# Altium project ECE_491.PrjPcb
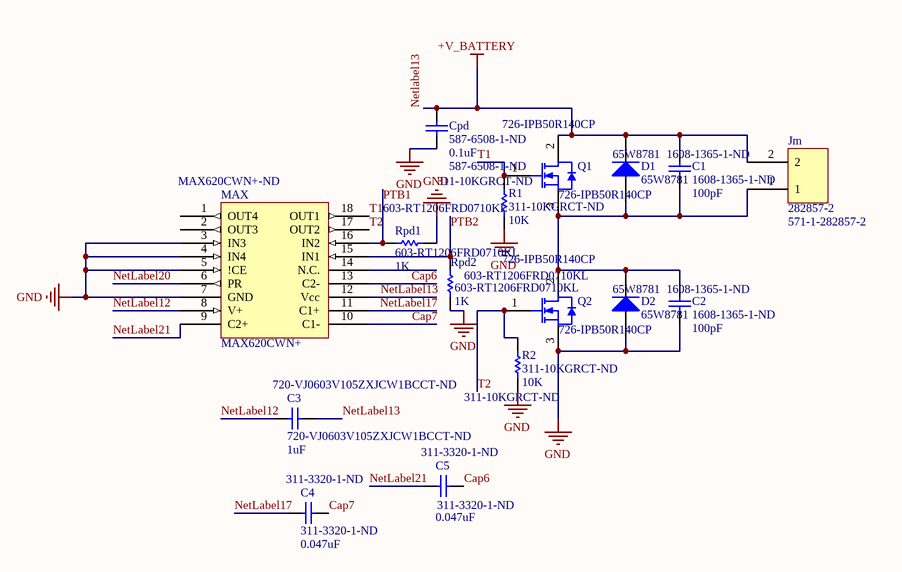
[diagram p0: MotorController.SchDoc]
3 sheets, 43 parts. Net scope: global (net labels, ports and power ports of the same name join across sheets).
Board file: FRDM-Shield3.PcbDoc
Sheets:
  MotorController.SchDoc
  Connectors.SchDoc
  PSU.SchDoc

## Sheet MotorController.SchDoc
size A

### Parts
C1  1608-1365-1-ND  value 100pF  [1608[0603]]
C2  1608-1365-1-ND  value 100pF  [1608[0603]]
C3  720-VJ0603V105ZXJCW1BCCT-ND  value 1uF  [C1206]
C4  311-3320-1-ND  value 0.047uF  [C1206]
C5  311-3320-1-ND  value 0.047uF  [C1206]
Cpd  587-6508-1-ND  value 0.1uF  [C1206]
D1  65W8781  [SMC]
D2  65W8781  [SMC]
Jm  282857-2  Supplier Part Number 1: 571-1-282857-2  [282857-2]
MAX  MAX620CWN+  Supplier Part Number 2: MAX620CWN+-ND  [SOIC-SO18_L]
Q1  726-IPB50R140CP  [INF-PG-TO263-3-2_N]
Q2  726-IPB50R140CP  [INF-PG-TO263-3-2_N]
R1  311-10KGRCT-ND  value 10K  [C1206]
R2  311-10KGRCT-ND  value 10K  [C1206]
Rpd1  603-RT1206FRD0710KL  value 1K  [C1206]
Rpd2  603-RT1206FRD0710KL  value 1K  [C1206]

### Nets
GND: C2.1 Cpd.1 D2.1(A) MAX.3(IN3) MAX.4(IN4) MAX.5(!CE) MAX.7(GND) Q2.3(SOURCE) R1.1 R2.1 Rpd1.2 Rpd2.1
NetLabel13: C1.2 C3.2 Cpd.2 D1.2(K) Jm.2 MAX.12(Vcc) Q1.2(DRAIN)  [also labelled +V_BATTERY]
Cap6: C5.1 MAX.13(C2-)
Cap7: C4.2 MAX.10(C1-)
NetLabel12: C3.1 MAX.8(V+)
NetLabel17: C4.1 MAX.11(C1+)
NetLabel20: MAX.6(PR)
NetLabel21: C5.2 MAX.9(C2+)
PTB1: MAX.16(IN2) Rpd1.1
PTB2: MAX.15(IN1) Rpd2.2
T1: MAX.18(OUT1) Q1.1(GATE) R1.2
T2: MAX.17(OUT2) Q2.1(GATE) R2.2
NetC1_1: C1.1 C2.2 D1.1(A) D2.2(K) Jm.1 Q1.3(SOURCE) Q2.2(DRAIN)

Not connected (* = marked no-connect by the designer): MAX 1(OUT4) 2(OUT3) 14(N.C.)

### Library data of the parts
C1 C2 = Cap: Multilayer Ceramic Capacitors MLCC - SMD/SMT 0603 100pF 50V 5% Tol C0G, Digi-key; Manufacturer: Knowles Syfer; Manufacturer Part Number: 0603Y0500101JCT; Dissipation Factor: 0.1%; Capacitance: 50pF; Published: 8-Jun-2000; LatestRevisionDate: 17-Jul-2002; LatestRevisionNote: Re-released for DXP Platform.; PackageReference: RAD-0.3; Publisher: Altium Limited; PackageDescription: Radial Cap, Thru-Hole; 2 Leads; 0.3 in Pin Spacing; Supplier 1: Digi-Key; Supplier 2: Digi-Key; Supplier Part Number 2: 1608-1365-1-ND; RoHS: Yes; Category: Ceramic Capacitors; Stock 2: 32028; Pricing 2: 1=0.59000, 10=0.42000, 100=0.27650, 500=0.20480, 1000=0.17407 (USD); Case/Package: 0603; Case Code (Imperial): 0603; Case Code (Metric): 1608; Min Operating Temperature: -55°C; Max Operating Temperature: 125°C; Termination: SMD/SMT; Composition: Ceramic; Dielectric: C0G; Tolerance: 5%; Packaging: Tape and Reel; Package Quantity: 4000; Voltage Rating: 50V; Voltage Rating (DC): 50V; Length: 1.6mm; Depth: 0.8mm; ComponentLink1URL: https://datasheet.ciiva.com/5428/tandardmlccdatasheet-369797-5428107.pdf?src-supplier=Mouser; ComponentLink1Description: https://datasheet.ciiva.com/5428/tandardmlccdatasheet-369797-5428107.pdf?src-supplier=Mouser
C3 = Cap: Cap Ceramic 1uF 16V Y5V -20% to 80% SMD 0603 85C Paper T/R, Digi-key; Manufacturer: Vishay Vitramon; Dielectric Material: Tantalum; Published: 8-Jun-2000; LatestRevisionDate: 17-Jul-2002; LatestRevisionNote: Re-released for DXP Platform.; PackageReference: RAD-0.3; Publisher: Altium Limited; PackageDescription: Radial Cap, Thru-Hole; 2 Leads; 0.3 in Pin Spacing; Supplier 1: Digi-Key; Supplier Part Number 1: 720-VJ0603V105ZXJCW1BCCT-ND; Manufacturer Part Number: VJ0603V105ZXJCW1BC; RoHS: Yes; Category: Ceramic Capacitors; Stock 1: 4000; Pricing 1: 1=0.29000, 10=0.19600, 100=0.09910, 500=0.06784, 1000=0.06001 (USD); Mount: Surface Mount; Case/Package: 0603; Min Operating Temperature: -25°C; Max Operating Temperature: 85°C; Capacitance: 1uF; Tolerance: 80%; Dielectric: Y5V; Voltage Rating (DC): 16V; Length: 1.6mm; Depth: 0.8mm; Lead Free: Lead Free; ComponentLink1URL: https://datasheet.ciiva.com/11489/vjw1bcbascomseries-11489855.pdf?src-supplier=Avnet; ComponentLink1Description: https://datasheet.ciiva.com/11489/vjw1bcbascomseries-11489855.pdf?src-supplier=Avnet
C4 C5 = Cap: CAP CER 0.47UF 4V X5R 0201, Digi-key; Manufacturer: Yageo; Manufacturer Part Number: CC0201MRX5R4BB474; Capacitance: 470nF; Tolerance: 20%; Published: 8-Jun-2000; LatestRevisionDate: 17-Jul-2002; LatestRevisionNote: Re-released for DXP Platform.; PackageReference: RAD-0.3; Publisher: Altium Limited; PackageDescription: Radial Cap, Thru-Hole; 2 Leads; 0.3 in Pin Spacing; Supplier 1: Digi-Key; Supplier Part Number 1: 311-3320-1-ND; RoHS: Yes; Category: Ceramic Capacitors; Stock 1: 31395; Pricing 1: 1=0.10000, 10=0.07100, 100=0.03150, 500=0.02252, 1000=0.01770, 2500=0.01609, 5000=0.01480 (USD); Mount: Surface Mount; Case/Package: 0201; Min Operating Temperature: -55°C; Max Operating Temperature: 85°C; Packaging: Tape and Reel; Voltage Rating: 4V; Length: 0.024inch; Width: 0.012inch; Thickness: 0.013inch; ComponentLink1URL: http://www.yageo.com/documents/recent/UPY-GPHC_X5R_4V-to-50V_23.pdf?src-supplier=Digi-Key; ComponentLink1Description: http://www.yageo.com/documents/recent/UPY-GPHC_X5R_4V-to-50V_23.pdf?src-supplier=Digi-Key; ComponentLink2URL: http://www.yageo.com/documents/recent/UPY-GPHC_X5R_4V-to-50V_25.pdf?src-supplier=Digi-Key; ComponentLink2Description: http://www.yageo.com/documents/recent/UPY-GPHC_X5R_4V-to-50V_25.pdf?src-supplier=Digi-Key
Cpd = Cap: Multilayer Ceramic Capacitor 0.1uF 50V 10% 1206 Emboss T/R, Digikey; Manufacturer: Taiyo Yuden; Manufacturer Part Number: UMF316B7104KLHT; Published: 8-Jun-2000; LatestRevisionDate: 17-Jul-2002; LatestRevisionNote: Re-released for DXP Platform.; PackageReference: RAD-0.3; Publisher: Altium Limited; PackageDescription: Radial Cap, Thru-Hole; 2 Leads; 0.3 in Pin Spacing; Supplier 1: Digi-Key; Supplier Part Number 1: 587-6508-1-ND; RoHS: No; Stock 1: 3880; Pricing 1: 1=0.48000, 10=0.33200, 100=0.19920, 500=0.14942, 1000=0.12618 (USD)
D1 D2 = Diode: MULTICOMP - 1N4007 - DIODE, STANDARD, 1A, 1000V,DO-41, Newark; Forward Voltage: 1.1V; Max Repetitive Reverse Voltage (Vrrm): 1kV; Max Forward Surge Current (Ifsm): 30A; Element Configuration: Single; Published: 8-Jun-2000; LatestRevisionDate: 17-Jul-2002; LatestRevisionNote: Re-released for DXP Platform.; PackageVersion: Sep-1996; PackageReference: SMC; Publisher: Altium Limited; PackageDescription: DO-214-AB/SMC; 2 C-Bend Leads; Body 7.9 x 5.9 mm, inc. leads (LxW); Code_JEDEC: DO-214-AB; Supplier 1: Newark; Supplier 2: Newark; Supplier Part Number 2: 65W8781; Manufacturer: Multicomp; Manufacturer Part Number: 1N4007; RoHS: Yes; Category: Rectifier Diodes; Stock 2: 270000; Pricing 2: 1=0.02200, 5000=0.02200, 10000=0.02000, 15000=0.01700, 25000=0.01400, 50000=0.01200 (USD); Number of Pins: 2; Min Operating Temperature: -65°C; Max Operating Temperature: 150°C; Forward Current: 1A; REACH SVHC: No SVHC; ComponentLink1URL: https://datasheet.ciiva.com/1176/58590-1176850.pdf?src-supplier=Element14; ComponentLink1Description: https://datasheet.ciiva.com/1176/58590-1176850.pdf?src-supplier=Element14; ComponentLink2URL: https://datasheet.ciiva.com/1176/41320-1176847.pdf?src-supplier=Element14; ComponentLink2Description: https://datasheet.ciiva.com/1176/41320-1176847.pdf?src-supplier=Element14; ComponentLink3URL: https://datasheet.ciiva.com/1239/1505911-1239362.pdf?src-supplier=Newark; ComponentLink3Description: https://datasheet.ciiva.com/1239/1505911-1239362.pdf?src-supplier=Newark
MAX = MAX620CPN: MAXIM INTEGRATED PRODUCTS         MAX620CWN+             MOSFET Driver, 4.5V-16.5V supply, WSOIC-18, Digi-key; Max Supply Current: 500uA; Number of Outputs: 4; Max Supply Voltage: 16.5V; Min Supply Voltage: 4.5V; Max Output Current: 25mA; Max Power Dissipation: 762mW; Fall Time: 2500ns; Rise Time: 1700ns; Supplier 1: Digi-Key; Manufacturer: Maxim; Manufacturer Part Number: MAX620CWN+; RoHS: Yes; Category: Gate Drivers; Stock 2: 99; Pricing 2: 1=7.24000, 10=6.54000, 25=6.23600, 100=5.17140, 250=4.71512, 500=4.67708 (USD); Mount: Surface Mount; Case/Package: SOIC; Number of Pins: 18; Min Operating Temperature: 0°C; Max Operating Temperature: 70°C; Number of Drivers: 4; Nominal Supply Current: 500uA; Packaging: Rail/Tube; Package Quantity: 40; Radiation Hardening: No; Lead Free: Lead Free; REACH SVHC: Unknown; ComponentLink1URL: https://datasheet.ciiva.com/26879/max620cwn-26879943.pdf?src-supplier=IIIC; ComponentLink1Description: https://datasheet.ciiva.com/26879/max620cwn-26879943.pdf?src-supplier=IIIC
Q1 Q2 = CMP-1164-00461-1: N-Channel CoolMOS Power-Transistor, 500 V VDS, 23 A ID, -55 to 150 degC, PG-TO263-3-2, Reel, Green, Mouser; Manufacturer: Infineon; Polarity: N; VGS(th) (max): 3.5Â V; RthJC (max): 0.65Â K/W; VGS(th) (min): 2.5Â V; VDS (max): 500Â V; RthJA (max): 62Â K/W; IDpuls (max): 56Â A; RDS (on) (max): 140Â mOhm; Green: TRUE; ID (max): 23Â A; QG: 48Â nC; Ptot (max): 192Â W; ComponentLink1URL: http://www.infineon.com/; PackageDescription: 3-Pin Plastic (Green) Transistor Single Outline Package, 10 x 9.25 mm Body, 2.54 mm Pitch; ComponentLink3URL: http://www.infineon.com/dgdl/BTS141TC_DS_10.pdf?folderId=db3a3043163797a6011667aa084c0e01&fileId=db3a3043242ebc9e01242f43f58b003e&location=en.Products.Automotive_ICs.Smart_High-_and_Low-Side_Switches.HITFET___TEMPFET__-_Smart_Low-Side_Switches.DATASHEET.BT; Technology: CoolMOS CP; ComponentLink3Description: Package Specification; PackageVersion: Jul-09; Halogen-free: TRUE; ComponentLink2URL: http://www.infineon.com/dgdl/IPB50R140CP_rev2.0.pdf?folderId=db3a304412b407950112b408e8c90004&fileId=db3a304412b407950112b42d4eb4484f; Packing: Reel; DatasheetVersion: Rev. 2.0; ComponentLink2Description: Datasheet; ComponentLink1Description: Manufacturer URL; PartNumber: IPB50R140CP; PackageReference: PG-TO263-3-2; Mounting Technology: Surface Mount; Rth: 0.65Â K/W; Supplier 1: Mouser; Supplier Part Number 1: 726-IPB50R140CP
R1 R2 = Res1: Surface Mount Thick Film Resistor, RC Series, 10 kohm, 100 mW, - 5%, 50 V, 0603 [1608 Metric], Digi-key; Manufacturer: Yageo; Manufacturer Part Number: RC0603JR-0710KL; Temperature Coefficient: 100ppm/°C; Resistance: 10kR; Voltage Rating (DC): 50V; Max Power Dissipation: 100mW; Published: 8-Jun-2000; LatestRevisionDate: 17-Jul-2002; LatestRevisionNote: Re-released for DXP Platform.; PackageReference: AXIAL-0.3; Publisher: Altium Limited; PackageDescription: Axial Device, Thru-Hole; 2 Leads; 0.3 in Pin Spacing; Supplier 1: Digi-Key; Supplier Part Number 1: 311-10KGRCT-ND; RoHS: Yes; Category: Chip SMD Resistors; Stock 1: 2424073; Pricing 1: 1=0.10000, 10=0.01900, 100=0.00770, 1000=0.00347, 2500=0.00301 (USD); Case/Package: 0603; Number of Pins: 2; Contact Plating: Tin,Matte; Case Code (Imperial): 0603; Case Code (Metric): 1608; Min Operating Temperature: -55°C; Max Operating Temperature: 155°C; Composition: Thick Film; Tolerance: 5%; Packaging: Tape and Reel; Features: Moisture Resistant; Number of Terminations: 2; Termination: SMD/SMT; Military Standard: Not; Power Rating: 100mW; Voltage Rating: 50V; Length: 0.063inch; Width: 0.031inch; Height - Seated (Max): 0.022inch; Depth: 0.8mm; Radiation Hardening: No; Lead Free: Lead Free; REACH SVHC: Unknown; ComponentLink1URL: https://datasheet.ciiva.com/2452/pyu-rc-group-51-rohs-l-10-2452848.pdf?src-supplier=Digi-Key; ComponentLink1Description: https://datasheet.ciiva.com/2452/pyu-rc-group-51-rohs-l-10-2452848.pdf?src-supplier=Digi-Key
Rpd1 Rpd2 = Res1: RES SMD 10K OHM 1% 1/4W 1206, Mouser; Manufacturer: Yageo; Max Power Dissipation: 250mW; Temperature Coefficient: 25ppm/°C; Resistance: 10kR; Published: 8-Jun-2000; LatestRevisionDate: 17-Jul-2002; LatestRevisionNote: Re-released for DXP Platform.; PackageReference: AXIAL-0.3; Publisher: Altium Limited; PackageDescription: Axial Device, Thru-Hole; 2 Leads; 0.3 in Pin Spacing; Supplier 1: Mouser; Supplier Part Number 1: 603-RT1206FRD0710KL; Manufacturer Part Number: RT1206FRD0710KL; RoHS: Yes; Category: Chip SMD Resistors; Stock 1: 8660; Pricing 1: 1=0.15000, 10=0.09100, 100=0.03000, 1000=0.02100, 5000=0.01600, 10000=0.01500 (USD); Case/Package: 1206; Min Operating Temperature: -55°C; Max Operating Temperature: 155°C; Tolerance: 1%; Packaging: Tape and Reel; Features: Moisture Resistant; Composition: Thin Film; Number of Terminations: 2; Length: 0.122inch; Height: 0.026inch; Width: 0.063inch; ComponentLink1URL: http://www.yageo.com/documents/recent/PYu-RT_1-to-0.01_RoHS_L_8.pdf?src-supplier=Digi-Key; ComponentLink1Description: http://www.yageo.com/documents/recent/PYu-RT_1-to-0.01_RoHS_L_8.pdf?src-supplier=Digi-Key
Jm = 282857-2: Supplier 1: Mouser

## Sheet Connectors.SchDoc: TRW-TFC
size D; SheetNumber: 1; SheetTotal: 2
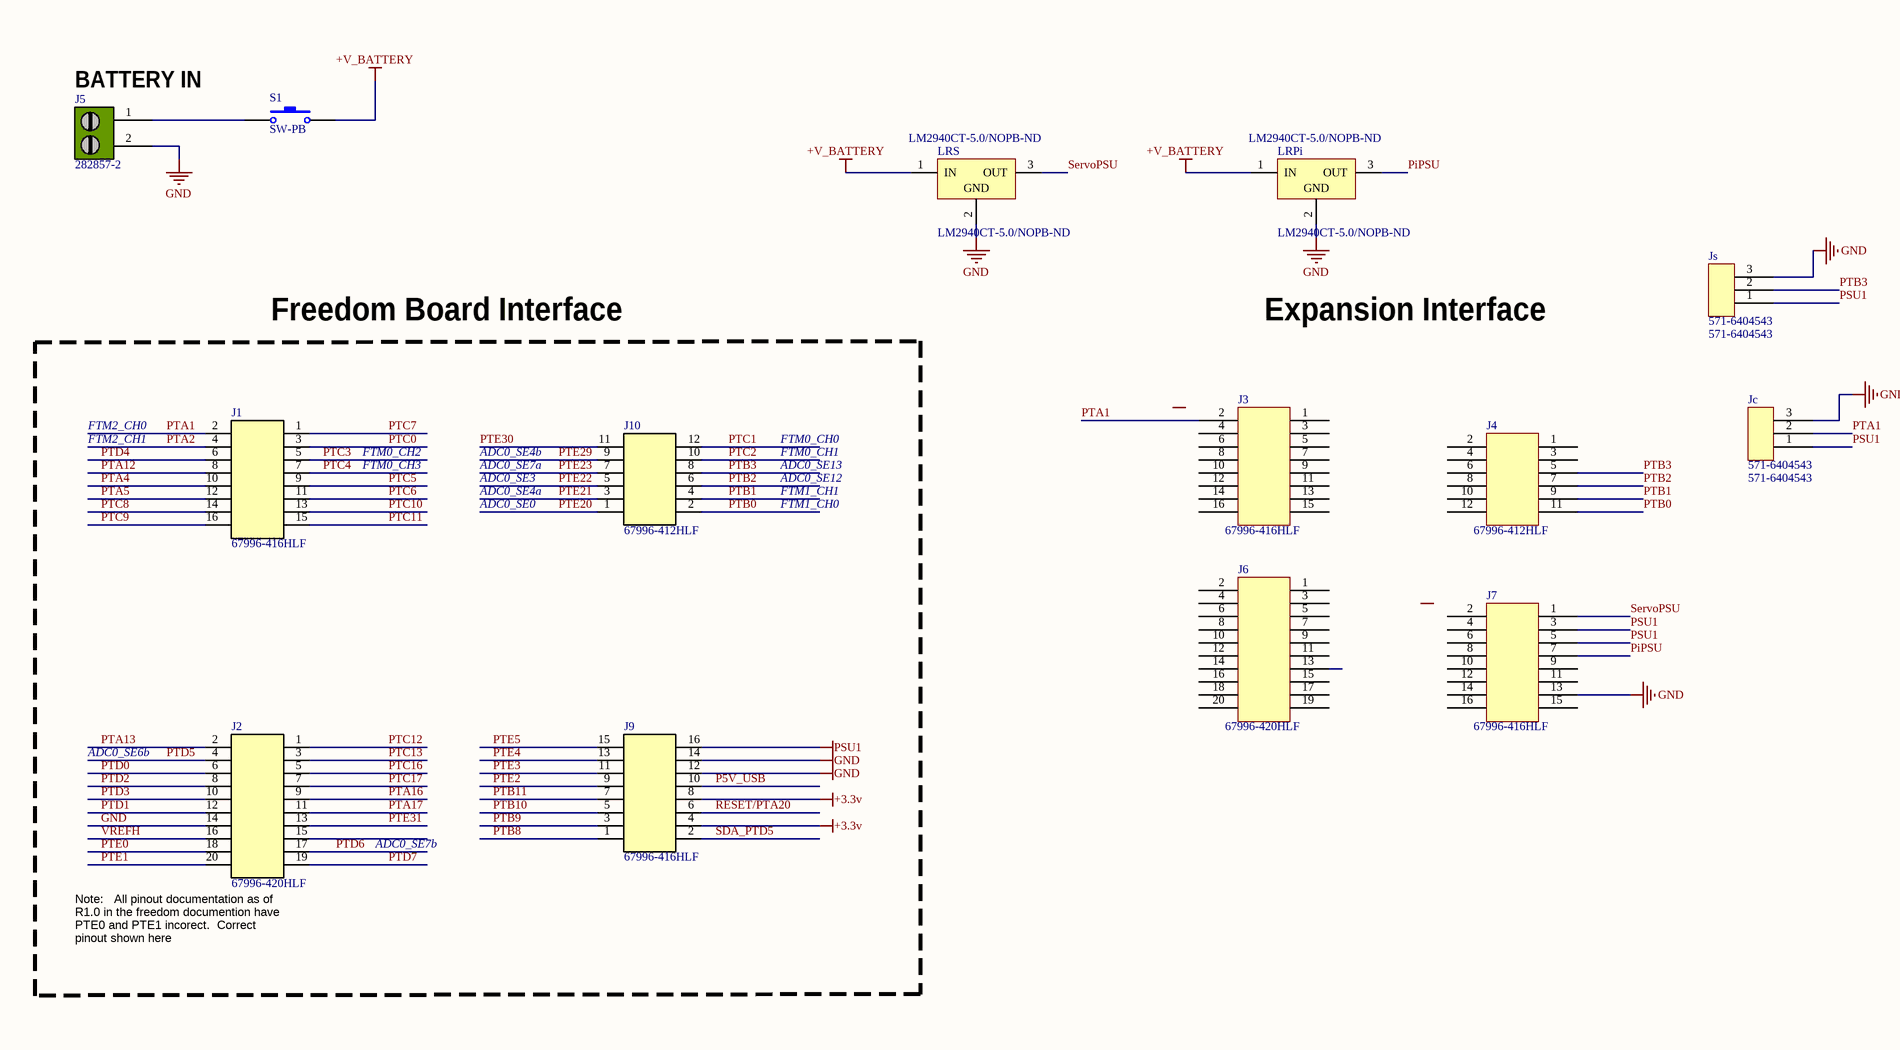
[diagram p1: Connectors.SchDoc, top left]
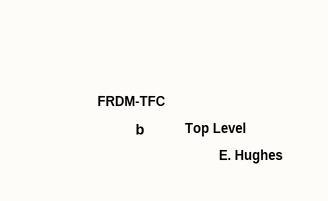
[diagram p2: Connectors.SchDoc, bottom right]

### Parts
J1  67996-416HLF  [67996-416HLF]
J2  67996-420HLF  [67996-420HLF]
J3  67996-416HLF  [67996-416HLF]
J4  67996-412HLF  [67996-412HLF]
J5  282857-2  [282857-2]
J6  67996-420HLF  [67996-420HLF]
J7  67996-416HLF  [67996-416HLF]
J9  67996-416HLF  [67996-416HLF]
J10  67996-412HLF  [67996-412HLF]
Jc  571-6404543  [6404543]
Js  571-6404543  [6404543]
LRPi  LM2940CT-5.0/NOPB-ND  [NDE0003A]
LRS  LM2940CT-5.0/NOPB-ND  [NDE0003A]
S1  SW-PB  [SPST]

### Blocks framed on the sheet
Freedom Board Interface: J1 J2 J9 J10

### Nets
+3.3v: J9.4 J9.8
+V_BATTERY: LRPi.1(IN) LRS.1(IN) S1.2  [project net NetLabel13]
GND: J2.14 J5.2 J7.13 J9.12 J9.14 Jc.3 Js.3 LRPi.2(GND) LRS.2(GND)
PSU1: J7.3 J7.5 J9.16 Jc.1 Js.1
P5V_USB: J9.10
PiPSU: J7.7 LRPi.3(OUT)
PTA1: J1.2 J3.2 Jc.2
PTA2: J1.4
PTA4: J1.10
PTA5: J1.12
PTA12: J1.8
PTA13: J2.2
PTA16: J2.9
PTA17: J2.11
PTB0: J4.11 J10.2
PTB1: J4.9 J10.4
PTB2: J4.7 J10.6
PTB3: J4.5 J10.8 Js.2
PTB8: J9.1
PTB9: J9.3
PTB10: J9.5
PTB11: J9.7
PTC0: J1.3
PTC1: J10.12
PTC2: J10.10
PTC3: J1.5
PTC4: J1.7
PTC5: J1.9
PTC6: J1.11
PTC7: J1.1
PTC8: J1.14
PTC9: J1.16
PTC10: J1.13
PTC11: J1.15
PTC12: J2.1
PTC13: J2.3
PTC16: J2.5
PTC17: J2.7
PTD0: J2.6
PTD1: J2.12
PTD2: J2.8
PTD3: J2.10
PTD4: J1.6
PTD5: J2.4
PTD6: J2.17
PTD7: J2.19
PTE0: J2.18
PTE1: J2.20
PTE2: J9.9
PTE3: J9.11
PTE4: J9.13
PTE5: J9.15
PTE20: J10.1
PTE21: J10.3
PTE22: J10.5
PTE23: J10.7
PTE29: J10.9
PTE30: J10.11
PTE31: J2.13
RESET/PTA20: J9.6
SDA_PTD5: J9.2
ServoPSU: J7.1 LRS.3(OUT)
VREFH: J2.16
NetJ5_1: J5.1 S1.1

Not connected (* = marked no-connect by the designer): J2 15; J3 1 3 4 5 6 7 8 9 10 11 12 13 14 15 16; J4 1 2 3 4 6 8 10 12; J6 1 2 3 4 5 6 7 8 9 10 11 12 13 14 15 16 17 18 19 20; J7 2 4 6 8 9 10 11 12 14 15 16

### Notes on the sheet
- (near J5) BATTERY IN
- Expansion Interface
- FTM2_CH0
- FTM2_CH1
- FTM0_CH2
- FTM0_CH3
- ADC0_SE4b
- ADC0_SE3
- ADC0_SE7a
- FTM0_CH0
- FTM0_CH1
- ADC0_SE12
- ADC0_SE13
- ADC0_SE0
- ADC0_SE4a
- FTM1_CH0
- FTM1_CH1
- ADC0_SE6b
- ADC0_SE7b
- (near J2) Note:   All pinout documentation as of R1.0 in the freedom documention have PTE0 and PTE1 incorect.  Correct pinout shown here
- FRDM-TFC
- b
- Top Level
- E. Hughes
- -1
- 2
- Wavenumber
- Technologies
- pl
- Rev:
- Sheet
- of

### Library data of the parts
J1 J9 = 67996-416HLF: CONN HEADER 16POS .100 STR TIN; Manufacturer: FCI; Connector Type: Header, Unshrouded; Number of Positions: 16; Number of Positions Loaded: All; Pitch: 0.100" (2.54mm); Manufacturer Part Number: 67996-416HLF; RoHS: RoHS Compliant; Category: Connectors, Interconnects; Contact Type: Male Pin; Number of Rows: 2; Row Spacing: 0.100" (2.54mm); Contact Mating Length: 0.230" (5.84mm); Mounting Type: Through Hole; Termination: Solder; Fastening Type: -; Features: -; Contact Finish: Tin; Contact Finish Thickness: 100µin (2.54µm); Color: Black; Packaging: Bulk; ComponentLink1URL: http://portal.fciconnect.com/Comergent//fci/drawing/67996.pdf; ComponentLink1Description: http://portal.fciconnect.com/Comergent//fci/drawing/67996.pdf; Value: 67996-416HLF; Supplier 1: Digi-Key; Supplier Part Number 1: 609-3220-ND; Stock 1: 1589; Pricing 1: 1=0.56, 10=0.521, 25=0.4684, 50=0.4164, 100=0.3991, 250=0.36436, 500=0.347, 1000=0.28628, 2500=0.26025 (USD)
J2 = 67996-420HLF: CONN HEADER 20POS .100 STR TIN; Manufacturer: FCI; Connector Type: Header, Unshrouded; Number of Positions: 20; Number of Positions Loaded: All; Pitch: 0.100" (2.54mm); Supplier 1: Digi-Key; Supplier Part Number 1: 609-3221-ND; Manufacturer Part Number: 67996-420HLF; RoHS: RoHS Compliant; Category: Connectors, Interconnects; Stock 1: 596; Pricing 1: 1=0.66, 10=0.619, 25=0.5572, 50=0.4952, 100=0.4745, 250=0.43324, 500=0.4126, 1000=0.3404, 2500=0.30945 (USD); Contact Type: Male Pin; Number of Rows: 2; Row Spacing: 0.100" (2.54mm); Contact Mating Length: 0.230" (5.84mm); Mounting Type: Through Hole; Termination: Solder; Fastening Type: -; Features: -; Contact Finish: Tin; Contact Finish Thickness: 100µin (2.54µm); Color: Black; Packaging: Bulk; ComponentLink1URL: http://portal.fciconnect.com/Comergent//fci/drawing/67996.pdf; ComponentLink1Description: http://portal.fciconnect.com/Comergent//fci/drawing/67996.pdf
J3 J7 = 67996-416HLF: CONN HEADER 16POS .100 STR TIN; Supplier 1: Octopart; Supplier Part Number 1: Mouser - 649-67996-416HLF
J4 = 67996-412HLF: CONN HEADER 12POS .100 STR TIN; Supplier 1: Octopart; Supplier Part Number 1: Mouser - 649-67996-412HLF
J5 = 282857-2: TERM BLOCK 2POS SIDE ENT 5.08MM; Manufacturer: TE Connectivity; Number of Levels: 1; Positions Per Level: 2; Pitch: 0.200" (5.08mm); Mating Orientation: Horizontal with Board; Current: 24A; Voltage: 300V; Wire Gauge: 12-30 AWG; Wire Termination: Screw - Rising Cage Clamp; Clamp Material - Plating: Brass - Nickel Plated; Torque - Screw: 0.79 Nm (7.0 Lb-In); Screw Thread: M3; Supplier 1: Digi-Key; Supplier Part Number 1: A98359-ND; Manufacturer Part Number: 282857-2; RoHS: RoHS Compliant; Category: Connectors, Interconnects; Stock 1: 1811; Pricing 1: 1=1.19, 10=1.046, 25=0.984, 50=0.9432, 100=0.9021, 250=0.82012, 500=0.7381, 1000=0.65608, 2500=0.59457 (USD); Mounting Type: Through Hole; Features: Interlocking (Side); Color: Green; Packaging: Bulk; Operating Temperature: -; Housing Material: Polyamide (PA66), Nylon 6/6; Contact Material - Plating: Brass - Tin Plated; Screw Material - Plating: Brass - Nickel Plated; ComponentLink1URL: http://documents.tycoelectronics.com/commerce/DocumentDelivery/DDEController?Action=srchrtrv&DocNm=282857&DocType=CD&DocLang=EN; ComponentLink1Description: http://documents.tycoelectronics.com/commerce/DocumentDelivery/DDEController?Action=srchrtrv&DocNm=282857&DocType=CD&DocLang=EN; Value: 282857-2
J6 = 67996-420HLF: CONN HEADER 20POS .100 STR TIN; Supplier 1: Octopart; Supplier Part Number 1: Mouser - 649-67996-420HLF
J10 = 67996-412HLF: CONN HEADER 12POS .100 STR TIN; Manufacturer: FCI; Connector Type: Header, Unshrouded; Number of Positions: 12; Number of Positions Loaded: All; Pitch: 0.100" (2.54mm); Supplier 1: Digi-Key; Supplier Part Number 1: 609-3219-ND; Manufacturer Part Number: 67996-412HLF; RoHS: RoHS Compliant; Category: Connectors, Interconnects; Stock 1: 1044; Pricing 1: 1=0.4, 10=0.379, 25=0.3248, 50=0.276, 100=0.2651, 250=0.23804, 500=0.22722, 1000=0.18935, 2500=0.17312 (USD); Contact Type: Male Pin; Number of Rows: 2; Row Spacing: 0.100" (2.54mm); Contact Mating Length: 0.230" (5.84mm); Mounting Type: Through Hole; Termination: Solder; Fastening Type: -; Features: -; Contact Finish: Tin; Contact Finish Thickness: 100µin (2.54µm); Color: Black; Packaging: Bulk; ComponentLink1URL: http://portal.fciconnect.com/Comergent//fci/drawing/67996.pdf; ComponentLink1Description: http://portal.fciconnect.com/Comergent//fci/drawing/67996.pdf; Value: 67996-412HLF
Jc Js = 640454-3: Headers & Wire Housings POLARIZED HEADER 3P Straight Post tin, Mouser; Supplier 1: Mouser; Supplier Part Number 1: 571-6404543
LRPi LRS = CMP-0062-02545-3: 1A Low Dropout Regulator, 3-pin TO-220, Pb-Free, Digi-key; Manufacturer: Texas Instruments; CompType: LDO IC; PowerWise: N; PackageTopMarking: NSUZXYTTE#*LM2940CT*-5.0 P+; RoHS: Y; ComponentLink1URL: http://www.ti.com/general/docs/lit/getliterature.tsp?genericPartNumber=LM2940C&fileType=pdf; PinCount: 3; ComponentLink1Description: Datasheet URL; PackageReference: NDE0003A; PackageDescription: TO-220, Molded, 3 Lead, Straight; Supplier 1: Digi-Key; Supplier Part Number 1: LM2940CT-5.0/NOPB-ND
S1 = SW-PB: Switch; Published: 24-Mar-1999; LatestRevisionDate: 17-Jul-2002; LatestRevisionNote: Re-released for DXP Platform.; PackageReference: SPST-2; Publisher: Altium Limited; PackageDescription: Switch; 2 Leads

## Sheet PSU.SchDoc
size A
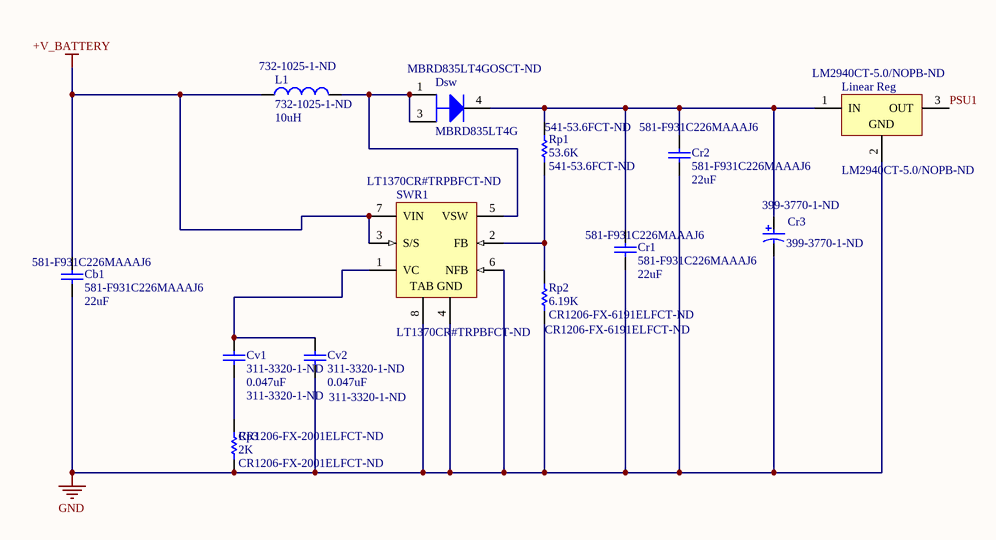
[diagram p3: PSU.SchDoc]

### Parts
Cb1  581-F931C226MAAAJ6  value 22uF  [C1206]
Cr1  581-F931C226MAAAJ6  value 22uF  [C1206]
Cr2  581-F931C226MAAAJ6  value 22uF  [C1206]
Cr3  399-3770-1-ND  [KEMT-T491-D_L]
Cv1  311-3320-1-ND  value 0.047uF  [C1206]
Cv2  311-3320-1-ND  value 0.047uF  [C1206]
Dsw  MBRD835LT4G  Supplier Part Number 1: MBRD835LT4GOSCT-ND  [ONSC-DPAK-3-369C-01_V]
L1  732-1025-1-ND  value 10uH  [2029]
Linear_Reg  LM2940CT-5.0/NOPB-ND  [NDE0003A]
Rp1  541-53.6FCT-ND  value 53.6K  [C1206]
Rp2  CR1206-FX-6191ELFCT-ND  value 6.19K  [C1206]
Rp3  CR1206-FX-2001ELFCT-ND  value 2K  [C1206]
SWR1  LT1370CR#TRPBFCT-ND  [LT-R-7_L]

### Nets
+V_BATTERY: Cb1.2 L1.1 SWR1.3(S/S) SWR1.7(VIN)  [project net NetLabel13]
GND: Cb1.1 Cr1.1 Cr2.1 Cr3.2 Cv2.2 Linear_Reg.2(GND) Rp2.1 Rp3.1 SWR1.4(GND) SWR1.6(NFB) SWR1.8(TAB)
PSU1: Linear_Reg.3(OUT)
NetCr1_2: Cr1.2 Cr2.2 Cr3.1 Dsw.4(K) Linear_Reg.1(IN) Rp1.2
NetCv1_1: Cv1.1 Cv2.1 SWR1.1(VC)
NetCv1_2: Cv1.2 Rp3.2
NetDsw_1: Dsw.1(A) Dsw.3(A) L1.2 SWR1.5(VSW)
NetRp1_1: Rp1.1 Rp2.2 SWR1.2(FB)

### Library data of the parts
Cb1 Cr1 Cr2 = Cap: Cap Tant Solid 22uF 16V A CASE 20% (3.2 X 1.6 X 1.6mm) Inward L SMD 3216-18 3 Ohm 125C Automotive T/R, Mouser; Manufacturer: Kyocera AVX; Published: 8-Jun-2000; LatestRevisionDate: 17-Jul-2002; LatestRevisionNote: Re-released for DXP Platform.; PackageReference: RAD-0.3; Publisher: Altium Limited; PackageDescription: Radial Cap, Thru-Hole; 2 Leads; 0.3 in Pin Spacing; Supplier 1: Mouser; Supplier Part Number 1: 581-F931C226MAAAJ6; Manufacturer Part Number: F931C226MAAAJ6; RoHS: No; Stock 1: 5204; Pricing 1: 1=0.64000, 10=0.45200, 100=0.28600, 500=0.22000, 1000=0.18700, 2000=0.14300 (USD)
Cr3 = CMP-2000-07541-1: Tantalum Surface Mount Capacitor, 100 uF, +/- 10%, 16 V, -55 to 125 degC, 2917 (7343 Metric), RoHS, Tape and Reel, Digi-key; Manufacturer: Kemet; Manufacturer Part Number: T491D107K016AT; ESR (Equivalent Series Resistance): 700mOhm; Dissipation Factor: 8%; Voltage Rating (DC): 16V; Case\/Package: Molded; Polarity: Polar; Capacitance: 100uF; Life (Hours): 2000Hour; Leakage Current: 16uA; Ripple Current: 463mA; RoHSCompliant: true; Datasheet Version: 07/2017; Case Code (Imperial): 2917; Width: 4.3mm; Height: 2.8mm; Min Operating Temperature: -55degC; Length: 7.3mm; Package Reference: T491-D; Dielectric Material: Tantalum; Packaging: TapeandReel; Max Operating Temperature: 125degC; Package Description: 2-Pin Surface Mount Device, Body 7.3 x 4.3 mm; Package Quantity: 1; Lead Free: LeadFree; Case Code (Metric): 7343; Voltage: 16V; Voltage Rating: 16V; Tolerance: 10%; Weight: 0.023634oz; Termination: SMD/SMT; Lead Pitch: 3.6mm; Manufacturer URL: http://www.kemet.com/; Datasheet URL: http://www.kemet.com/Lists/ProductCatalog/Attachments/254/KEM_T2005_T491.pdf; Radiation Hardening: No; Mount: PCB; Height - Seated (Max): 0.122inch; Mounting Technology: SurfaceMount; Depth: 4.3mm; REACH SVHC: NoSVHC; Supplier 1: Digi-Key; Supplier Part Number 1: 399-3770-1-ND; RoHS: Yes; Category: Tantalum Capacitors; Stock 1: 119781; Pricing 1: 1=1.30000, 10=1.02600, 100=0.76930 (USD); Case/Package: Molded; Features: General Purpose; ComponentLink1URL: https://datasheet.ciiva.com/20171/458379-da-en-01-20171921.pdf?src-supplier=Rapid+Electronics; ComponentLink1Description: https://datasheet.ciiva.com/20171/458379-da-en-01-20171921.pdf?src-supplier=Rapid+Electronics; ComponentLink2URL: https://datasheet.ciiva.com/27052/1574225-27052588.pdf?src-supplier=Jameco; ComponentLink2Description: https://datasheet.ciiva.com/27052/1574225-27052588.pdf?src-supplier=Jameco; ComponentLink3URL: https://datasheet.ciiva.com/5934/1732757-5934631.pdf?src-supplier=Farnell; ComponentLink3Description: https://datasheet.ciiva.com/5934/1732757-5934631.pdf?src-supplier=Farnell; ComponentLink4URL: https://datasheet.ciiva.com/26341/458379-da-01-en-kondensator-100uf-7343-10pr-16v-85c-26341618.pdf?src-supplier=Conrad; ComponentLink4Description: https://datasheet.ciiva.com/26341/458379-da-01-en-kondensator-100uf-7343-10pr-16v-85c-26341618.pdf?src-supplier=Conrad; ComponentLink5URL: https://datasheet.ciiva.com/260/kem-t2005-t491-260262.pdf?src-supplier=Digi-Key; ComponentLink5Description: https://datasheet.ciiva.com/260/kem-t2005-t491-260262.pdf?src-supplier=Digi-Key; ComponentLink6URL: https://datasheet.ciiva.com/260/kem-t2005-t491-260263.pdf?src-supplier=Digi-Key; ComponentLink6Description: https://datasheet.ciiva.com/260/kem-t2005-t491-260263.pdf?src-supplier=Digi-Key; ComponentLink7URL: https://datasheet.ciiva.com/41657/1854511-41657335.pdf?src-supplier=Farnell; ComponentLink7Description: https://datasheet.ciiva.com/41657/1854511-41657335.pdf?src-supplier=Farnell; ComponentLink8URL: https://datasheet.ciiva.com/260/kem-t2005-t491-260264.pdf?src-supplier=Digi-Key; ComponentLink8Description: https://datasheet.ciiva.com/260/kem-t2005-t491-260264.pdf?src-supplier=Digi-Key; ComponentLink9URL: https://datasheet.ciiva.com/14595/70095774-14595116.pdf?src-supplier=Allied+Electronics; ComponentLink9Description: https://datasheet.ciiva.com/14595/70095774-14595116.pdf?src-supplier=Allied+Electronics; ComponentLink10URL: https://datasheet.ciiva.com/7696/1854511-7696350.pdf?src-supplier=Element14; ComponentLink10Description: https://datasheet.ciiva.com/7696/1854511-7696350.pdf?src-supplier=Element14; ComponentLink11URL: https://datasheet.ciiva.com/14588/70095774-14588350.pdf?src-supplier=Allied+Electronics; ComponentLink11Description: https://datasheet.ciiva.com/14588/70095774-14588350.pdf?src-supplier=Allied+Electronics; ComponentLink12URL: https://datasheet.ciiva.com/7696/1854511-7696351.pdf?src-supplier=Element14; ComponentLink12Description: https://datasheet.ciiva.com/7696/1854511-7696351.pdf?src-supplier=Element14
Cv1 Cv2 = Cap: as C4 on sheet MotorController; Published: 8-Jun-2000; LatestRevisionDate: 17-Jul-2002; LatestRevisionNote: Re-released for DXP Platform.; PackageReference: RAD-0.3; Publisher: Altium Limited; PackageDescription: Radial Cap, Thru-Hole; 2 Leads; 0.3 in Pin Spacing; Supplier 1: Digi-Key; Supplier Part Number 1: 311-3320-1-ND; RoHS: Yes; Category: Ceramic Capacitors; Stock 1: 31395; Pricing 1: 1=0.10000, 10=0.07100, 100=0.03150, 500=0.02252, 1000=0.01770, 2500=0.01609, 5000=0.01480 (USD); Mount: Surface Mount; Case/Package: 0201; Min Operating Temperature: -55°C; Max Operating Temperature: 85°C; Packaging: Tape and Reel; Voltage Rating: 4V; Length: 0.024inch; Width: 0.012inch; Thickness: 0.013inch; ComponentLink1URL: http://www.yageo.com/documents/recent/UPY-GPHC_X5R_4V-to-50V_23.pdf?src-supplier=Digi-Key; ComponentLink1Description: http://www.yageo.com/documents/recent/UPY-GPHC_X5R_4V-to-50V_23.pdf?src-supplier=Digi-Key; ComponentLink2URL: http://www.yageo.com/documents/recent/UPY-GPHC_X5R_4V-to-50V_25.pdf?src-supplier=Digi-Key; ComponentLink2Description: http://www.yageo.com/documents/recent/UPY-GPHC_X5R_4V-to-50V_25.pdf?src-supplier=Digi-Key
Dsw = CMP-1055-00173-1: SWITCHMODE(TM) Power Rectifier, 3-Pin DPAK, Pb-Free, Tape and Reel, Digi-key; Manufacturer: On Semiconductor; IFSM Max (A): 75; Configuration: Single; ComponentLink3URL: http://www.onsemi.cn/pub_link/Collateral/369C.PDF; ComponentLink2URL: http://www.onsemi.cn/pub_link/Collateral/MBRD835L-D.PDF; RoHS: TRUE; PackageVersion: Rev. E, 02/2014; Mounting Technology: Surface Mount; PackageDescription: 3-Pin Flange Mount, Body 6.54 x 6.095 mm, Pitch 2.29 mm; PartNumber: MBRD835LT4G; ComponentLink1URL: http://www.onsemi.com/; PackageReference: DPAK-3-369C-01; Packing: Tape and Reel; ComponentLink1Description: Manufacturer URL; ComponentLink2Description: Datasheet; DatasheetVersion: Rev. 11; ComponentLink3Description: Package Specification; Supplier 1: Digi-Key
L1 = Inductor: Inductor, SMD 10 uH 1.3 A ±30%, 744042100, Würth Elektronik, Digi-key; Manufacturer: Wurth Electronics; Code_IEC: 1005; Core Material: Ferrite; DC Resistance (DCR): 150mR; Max DC Current: 1.3A; Self Resonant Frequency: 45MHz; Shielding: Shielded; Test Frequency: 100kHz; Saturation Current: 1A; Published: 8-Jun-2000; LatestRevisionDate: 29-May-2009; LatestRevisionNote: IPC-7351 Footprint Added.; PackageReference: 0402-A; Publisher: Altium Limited; PackageDescription: Chip Inductor; Code_JEITA: 0402; Supplier 1: Digi-Key; Supplier Part Number 1: 732-1025-1-ND; Manufacturer Part Number: 744042100; RoHS: Yes; Category: Fixed Inductors; Stock 1: 16164; Pricing 1: 1=1.43000, 10=1.38900, 50=1.21500, 100=1.11100 (USD); Mount: Surface Mount; Case/Package: 1919; Number of Pins: 2; Weight: 0.00582oz; Case Code (Imperial): 1919; Case Code (Metric): 4848; Min Operating Temperature: -40°C; Max Operating Temperature: 125°C; Termination: SMD/SMT; Packaging: Tape and Reel; Inductance: 10uH; Tolerance: 30%; Package Quantity: 800; Inductance Tolerance: 30%; Current Rating: 1.3A; RMS Current (Irms): 1.3A; Composition: Wirewound; Series Resistance: 150mR; Length: 4.8mm; Height: 1.8mm; Width: 4.8mm; Depth: 4.8mm; Height - Seated (Max): 0.079inch; REACH SVHC: Unknown; Lead Free: Lead Free; ComponentLink1URL: https://datasheet.ciiva.com/13320/744042100-88981-13320858.pdf?src-supplier=Mouser; ComponentLink1Description: https://datasheet.ciiva.com/13320/744042100-88981-13320858.pdf?src-supplier=Mouser; ComponentLink2URL: https://datasheet.ciiva.com/11800/0900766b8079f7c1-11800146.pdf?src-supplier=RSComponents; ComponentLink2Description: https://datasheet.ciiva.com/11800/0900766b8079f7c1-11800146.pdf?src-supplier=RSComponents; ComponentLink3URL: https://datasheet.ciiva.com/22702/744042100-22702643.pdf?src-supplier=Element14; ComponentLink3Description: https://datasheet.ciiva.com/22702/744042100-22702643.pdf?src-supplier=Element14; ComponentLink4URL: https://datasheet.ciiva.com/1050/744042100-1050948.pdf?src-supplier=Digi-Key; ComponentLink4Description: https://datasheet.ciiva.com/1050/744042100-1050948.pdf?src-supplier=Digi-Key; ComponentLink5URL: https://datasheet.ciiva.com/1050/744042100-1050950.pdf?src-supplier=Digi-Key; ComponentLink5Description: https://datasheet.ciiva.com/1050/744042100-1050950.pdf?src-supplier=Digi-Key; ComponentLink6URL: https://datasheet.ciiva.com/1050/744042100-1050949.pdf?src-supplier=Digi-Key; ComponentLink6Description: https://datasheet.ciiva.com/1050/744042100-1050949.pdf?src-supplier=Digi-Key; ComponentLink7URL: https://datasheet.ciiva.com/7754/744042100-7754411.pdf?src-supplier=Element14; ComponentLink7Description: https://datasheet.ciiva.com/7754/744042100-7754411.pdf?src-supplier=Element14
Linear_Reg = CMP-0062-02545-3: as LRPi on sheet Connectors; RoHS: Y; ComponentLink1URL: http://www.ti.com/general/docs/lit/getliterature.tsp?genericPartNumber=LM2940C&fileType=pdf; PinCount: 3; ComponentLink1Description: Datasheet URL; PackageReference: NDE0003A; PackageDescription: TO-220, Molded, 3 Lead, Straight; Supplier 1: Digi-Key; Supplier Part Number 1: LM2940CT-5.0/NOPB-ND
Rp1 = Res1: Res Thick Film 1206 53.6 Ohm 1% 0.25W(1/4W) ±100ppm/C Molded SMD Automotive Paper T/R, Digi-key; Manufacturer: Vishay; Manufacturer Part Number: CRCW120653R6FKEA; Resistance: 53.6R; Power Rating: 250mW; Voltage Rating (DC): 200V; Temperature Coefficient: 100ppm/°C; Published: 8-Jun-2000; LatestRevisionDate: 17-Jul-2002; LatestRevisionNote: Re-released for DXP Platform.; PackageReference: AXIAL-0.3; Publisher: Altium Limited; PackageDescription: Axial Device, Thru-Hole; 2 Leads; 0.3 in Pin Spacing; Supplier 1: Digi-Key; Supplier Part Number 1: 541-53.6FCT-ND; RoHS: Yes; Category: Chip SMD Resistors; Stock 1: 787; Pricing 1: 1=0.10000, 10=0.07600, 100=0.02930, 1000=0.01287, 2500=0.01112 (USD); Case/Package: 1206; Number of Pins: 2; Weight: 0.000353oz; Contact Plating: Tin; Case Code (Metric): 3216; Case Code (Imperial): 1206; Min Operating Temperature: -55°C; Max Operating Temperature: 155°C; Package Quantity: 10; Packaging: Tape and Reel; Termination: SMD/SMT; Tolerance: 1%; Number of Terminations: 2; Voltage Rating: 200V; Composition: Thick Film; Max Power Dissipation: 250mW; Military Standard: Not; Features: Automotive AEC-Q200; Length: 3.2mm; Height: 0.024inch; Depth: 1.6mm; Width: 0.063inch; Radiation Hardening: No; REACH SVHC: Unknown; Lead Free: Lead Free; ComponentLink1URL: https://datasheet.ciiva.com/2497/dcrcwe3-2497248.pdf?src-supplier=Digi-Key; ComponentLink1Description: https://datasheet.ciiva.com/2497/dcrcwe3-2497248.pdf?src-supplier=Digi-Key; ComponentLink2URL: https://datasheet.ciiva.com/9000/dcrcwe3-9000149.pdf?src-supplier=Avnet; ComponentLink2Description: https://datasheet.ciiva.com/9000/dcrcwe3-9000149.pdf?src-supplier=Avnet; ComponentLink3URL: https://datasheet.ciiva.com/5543/dcrcwe3-109170-5543196.pdf?src-supplier=Mouser; ComponentLink3Description: https://datasheet.ciiva.com/5543/dcrcwe3-109170-5543196.pdf?src-supplier=Mouser; ComponentLink4URL: https://datasheet.ciiva.com/22699/1697337-22699228.pdf?src-supplier=Element14; ComponentLink4Description: https://datasheet.ciiva.com/22699/1697337-22699228.pdf?src-supplier=Element14; ComponentLink5URL: https://datasheet.ciiva.com/7732/1697337-7732205.pdf?src-supplier=Element14; ComponentLink5Description: https://datasheet.ciiva.com/7732/1697337-7732205.pdf?src-supplier=Element14; ComponentLink6URL: https://datasheet.ciiva.com/2497/dcrcwe3-2497246.pdf?src-supplier=Digi-Key; ComponentLink6Description: https://datasheet.ciiva.com/2497/dcrcwe3-2497246.pdf?src-supplier=Digi-Key; ComponentLink7URL: https://datasheet.ciiva.com/7732/1697337-7732206.pdf?src-supplier=Element14; ComponentLink7Description: https://datasheet.ciiva.com/7732/1697337-7732206.pdf?src-supplier=Element14; ComponentLink8URL: https://datasheet.ciiva.com/2497/dcrcwe3-2497247.pdf?src-supplier=Digi-Key; ComponentLink8Description: https://datasheet.ciiva.com/2497/dcrcwe3-2497247.pdf?src-supplier=Digi-Key
Rp2 = Res1: Thick Film Resistors 6.19K 1%,Digi-key; Manufacturer: Bourns; Max Power Dissipation: 250mW; Temperature Coefficient: 100ppm/°C; Resistance: 6.19kR; Voltage Rating: 200V; Published: 8-Jun-2000; LatestRevisionDate: 17-Jul-2002; LatestRevisionNote: Re-released for DXP Platform.; PackageReference: AXIAL-0.3; Publisher: Altium Limited; PackageDescription: Axial Device, Thru-Hole; 2 Leads; 0.3 in Pin Spacing; Supplier 1: Digi-Key; Supplier Part Number 1: CR1206-FX-6191ELFCT-ND; Manufacturer Part Number: CR1206-FX-6191ELF; RoHS: Yes; Category: Chip SMD Resistors; Stock 1: 19832; Pricing 1: 1=0.11000, 10=0.09400, 100=0.03630, 1000=0.01597, 2500=0.01380 (USD); Mount: Surface Mount; Case/Package: 1206; Contact Plating: Tin; Case Code (Imperial): 1206; Case Code (Metric): 3216; Min Operating Temperature: -55°C; Max Operating Temperature: 155°C; Termination: SMD/SMT; Number of Terminations: 2; Military Standard: Not; Composition: Thick Film; Tolerance: 1%; Power Rating: 250mW; Packaging: Tape and Reel; Package Quantity: 5000; Length: 3.2mm; Height: 0.03inch; Depth: 1.6mm; Width: 1.6mm; Thickness: 610um; Radiation Hardening: No; ComponentLink1URL: https://datasheet.ciiva.com/5542/chpreztr-5542280.pdf?src-supplier=Mouser; ComponentLink1Description: https://datasheet.ciiva.com/5542/chpreztr-5542280.pdf?src-supplier=Mouser; ComponentLink2URL: https://datasheet.ciiva.com/9122/chpreztr-9122638.pdf?src-supplier=Avnet; ComponentLink2Description: https://datasheet.ciiva.com/9122/chpreztr-9122638.pdf?src-supplier=Avnet
Rp3 = Res1: BOURNS - CR1206-FX-2001ELF - RES, 2K, 1%, 0.25W, 1206, THICK FILM, Digi-key; Temperature Coefficient: 100ppm/°C; Resistance: 2kR; Power Rating: 250mW; Voltage Rating: 200V; Published: 8-Jun-2000; LatestRevisionDate: 17-Jul-2002; LatestRevisionNote: Re-released for DXP Platform.; PackageReference: AXIAL-0.3; Publisher: Altium Limited; PackageDescription: Axial Device, Thru-Hole; 2 Leads; 0.3 in Pin Spacing; Supplier 1: Digi-Key; Supplier Part Number 1: CR1206-FX-2001ELFCT-ND; Manufacturer: Bourns; Manufacturer Part Number: CR1206-FX-2001ELF; RoHS: Yes; Category: Chip SMD Resistors; Stock 1: 36084; Pricing 1: 1=0.10000, 10=0.03800, 100=0.01560, 1000=0.00700, 2500=0.00607 (USD); Mount: Surface Mount; Case/Package: 1206; Number of Pins: 2; Contact Plating: Tin; Case Code (Metric): 3216; Case Code (Imperial): 1206; Min Operating Temperature: -55°C; Max Operating Temperature: 155°C; Number of Terminations: 2; Termination: SMD/SMT; Military Standard: Not; Composition: Thick Film; Tolerance: 1%; Packaging: Tape and Reel; Package Quantity: 1; Features: Moisture Resistant; Voltage Rating (DC): 200V; Max Power Dissipation: 250mW; Length: 3.2mm; Height: 0.03inch; Depth: 1.6mm; Width: 1.6mm; Thickness: 610um; Radiation Hardening: No; REACH SVHC: No SVHC; ComponentLink1URL: https://datasheet.ciiva.com/9123/chpreztr-9123286.pdf?src-supplier=Avnet; ComponentLink1Description: https://datasheet.ciiva.com/9123/chpreztr-9123286.pdf?src-supplier=Avnet; ComponentLink2URL: https://datasheet.ciiva.com/6547/chpreztr-6547512.pdf?src-supplier=Digi-Key; ComponentLink2Description: https://datasheet.ciiva.com/6547/chpreztr-6547512.pdf?src-supplier=Digi-Key; ComponentLink3URL: https://datasheet.ciiva.com/6547/chpreztr-6547518.pdf?src-supplier=Digi-Key; ComponentLink3Description: https://datasheet.ciiva.com/6547/chpreztr-6547518.pdf?src-supplier=Digi-Key; ComponentLink4URL: https://datasheet.ciiva.com/46383/691949-46383774.pdf?src-supplier=Element14; ComponentLink4Description: https://datasheet.ciiva.com/46383/691949-46383774.pdf?src-supplier=Element14; ComponentLink5URL: https://datasheet.ciiva.com/22713/691949-22713279.pdf?src-supplier=Element14; ComponentLink5Description: https://datasheet.ciiva.com/22713/691949-22713279.pdf?src-supplier=Element14; ComponentLink6URL: https://datasheet.ciiva.com/5543/chpreztr-5543718.pdf?src-supplier=Mouser; ComponentLink6Description: https://datasheet.ciiva.com/5543/chpreztr-5543718.pdf?src-supplier=Mouser; ComponentLink7URL: https://datasheet.ciiva.com/16927/chpreztr-16927448.pdf?src-supplier=Avnet+Europe; ComponentLink7Description: https://datasheet.ciiva.com/16927/chpreztr-16927448.pdf?src-supplier=Avnet+Europe; ComponentLink8URL: https://datasheet.ciiva.com/6547/chpreztr-6547515.pdf?src-supplier=Digi-Key; ComponentLink8Description: https://datasheet.ciiva.com/6547/chpreztr-6547515.pdf?src-supplier=Digi-Key; ComponentLink9URL: https://datasheet.ciiva.com/48692/001055531-da-01-en-smd-wid-cr1206-fx-2001elf-2k-ohm-1-4w-48692026.pdf?src-supplier=Conrad; ComponentLink9Description: https://datasheet.ciiva.com/48692/001055531-da-01-en-smd-wid-cr1206-fx-2001elf-2k-ohm-1-4w-48692026.pdf?src-supplier=Conrad
SWR1 = CMP-0491-01356-1: 500 kHz High Efficiency 6 A Switching Regulator, 7-pin DPAK (R-7), 0 to 125 degC, Digi-key; Manufacturer: Linear Technology; Frequency Sync Range: 600kHz - 800kHz; Number of Outputs: 1; ComponentLink3URL: http://cds.linear.com/docs/en/packaging/05081462_F_R.pdf; ComponentLink3Description: Package Specification; RoHS: FALSE; PackageReference: R-7; ComponentLink2URL: http://cds.linear.com/docs/en/datasheet/1370fs.pdf; Mounting Technology: Surface Mount; ComponentLink1Description: Manufacturer URL; ComponentLink2Description: Datasheet; ComponentLink1URL: http://www.linear.com/; PackageDescription: 7-Pin Plastic DD Pak, Body 10.2235 x 8.89 mm, Pitch 1.27 mm; PackageVersion: Rev. F, 05/2012; PartNumber: LT1370CR; Supplier 1: Digi-Key; Supplier Part Number 1: LT1370CR#TRPBFCT-ND

## Nets that join several sheets
GND: MotorController (12 pins), Connectors (9 pins), PSU (11 pins)
NetLabel13: MotorController (7 pins), Connectors (LRPi.1 LRS.1 S1.2), PSU (Cb1.2 L1.1 SWR1.3 SWR1.7)
PSU1: Connectors (5 pins), PSU (Linear_Reg.3)
PTB1: MotorController (MAX.16 Rpd1.1), Connectors (J4.9 J10.4)
PTB2: MotorController (MAX.15 Rpd2.2), Connectors (J4.7 J10.6)